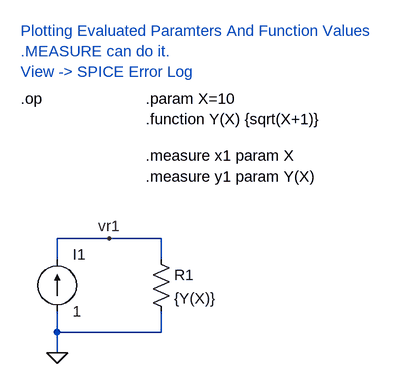
[diagram p0: schematic param_func_measure.asc]
param_func_measure.asc, the LTspice schematic file:
Version 4
SHEET 1 880 680
WIRE -48 224 -128 224
WIRE 32 224 -48 224
WIRE -128 256 -128 224
WIRE 32 256 32 224
WIRE -128 368 -128 336
WIRE 32 368 32 336
WIRE 32 368 -128 368
WIRE -128 400 -128 368
FLAG -128 400 0
FLAG -48 224 vr1
SYMBOL res 16 240 R0
SYMATTR InstName R1
SYMATTR Value {Y(X)}
SYMBOL current -128 336 M180
WINDOW 0 24 88 Left 0
WINDOW 3 24 0 Left 0
SYMATTR InstName I1
SYMATTR Value 1
TEXT 8 8 Left 0 !.param X=10
TEXT 8 40 Left 0 !.function Y(X) {sqrt(X+1)}
TEXT 8 96 Left 0 !.measure x1 param X
TEXT 8 128 Left 0 !.measure y1 param Y(X)
TEXT -184 8 Left 0 !.op
TEXT -184 -96 Left 0 ;Plotting Evaluated Paramters And Function Values\n.MEASURE can do it.\nView -> SPICE Error Log

The netlist it stands for:
* param_func_measure.asc
R1 vr1 0 {Y(X)}
I1 0 vr1 1
.param X=10
.function Y(X) {sqrt(X+1)}
.measure x1 param X
.measure y1 param Y(X)
.op
* Plotting Evaluated Paramters And Function Values
* .MEASURE can do it.
* View -> SPICE Error Log
.backanno
.end